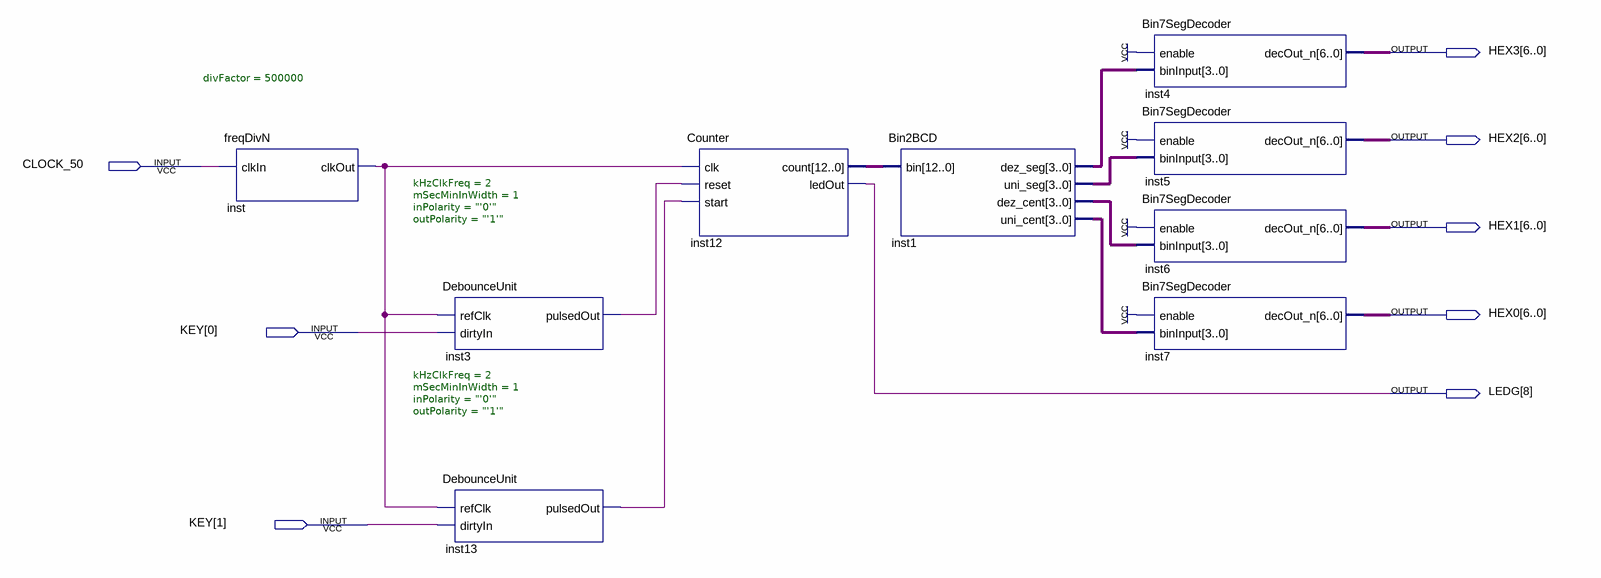
[diagram p0: schematic sheet]
// Quartus schematic Fase2.bdf as structural Verilog: 9 symbols, 8 pins
module Fase2 (
  input  CLOCK_50,
  input  [1:0] KEY,
  output [6:0] HEX3,
  output [6:0] HEX2,
  output [6:0] HEX1,
  output [6:0] HEX0,
  output [8:8] LEDG
);

  wire inst3_pulsedout, inst13_pulsedout, inst_clkout;
  wire [3:0] inst1_dez_cent, inst1_dez_seg, inst1_uni_cent, inst1_uni_seg;
  wire [12:0] inst12_count;

  freqDivN #(.divFactor(500000)) inst (.clkIn(CLOCK_50), .clkOut(inst_clkout));
  DebounceUnit #(.kHzClkFreq(2), .mSecMinInWidth(1), .inPolarity("'0'"), .outPolarity("'1'")) inst3 (
    .refClk(inst_clkout), .dirtyIn(KEY[0]), .pulsedOut(inst3_pulsedout));
  DebounceUnit #(.kHzClkFreq(2), .mSecMinInWidth(1), .inPolarity("'0'"), .outPolarity("'1'")) inst13 (
    .refClk(inst_clkout), .dirtyIn(KEY[1]), .pulsedOut(inst13_pulsedout));
  Counter inst12 (
    .clk(inst_clkout), .reset(inst3_pulsedout), .start(inst13_pulsedout), .count(inst12_count),
    .ledOut(LEDG[8]));
  Bin2BCD inst1 (
    .bin(inst12_count), .dez_seg(inst1_dez_seg), .uni_seg(inst1_uni_seg), .dez_cent(inst1_dez_cent),
    .uni_cent(inst1_uni_cent));
  Bin7SegDecoder inst4 (.enable(1'b1), .binInput(inst1_dez_seg), .decOut_n(HEX3));
  Bin7SegDecoder inst5 (.enable(1'b1), .binInput(inst1_uni_seg), .decOut_n(HEX2));
  Bin7SegDecoder inst6 (.enable(1'b1), .binInput(inst1_dez_cent), .decOut_n(HEX1));
  Bin7SegDecoder inst7 (.enable(1'b1), .binInput(inst1_uni_cent), .decOut_n(HEX0));
endmodule
